# EAGLE schematic sensor pcb 3 (EAGLE 6.1)
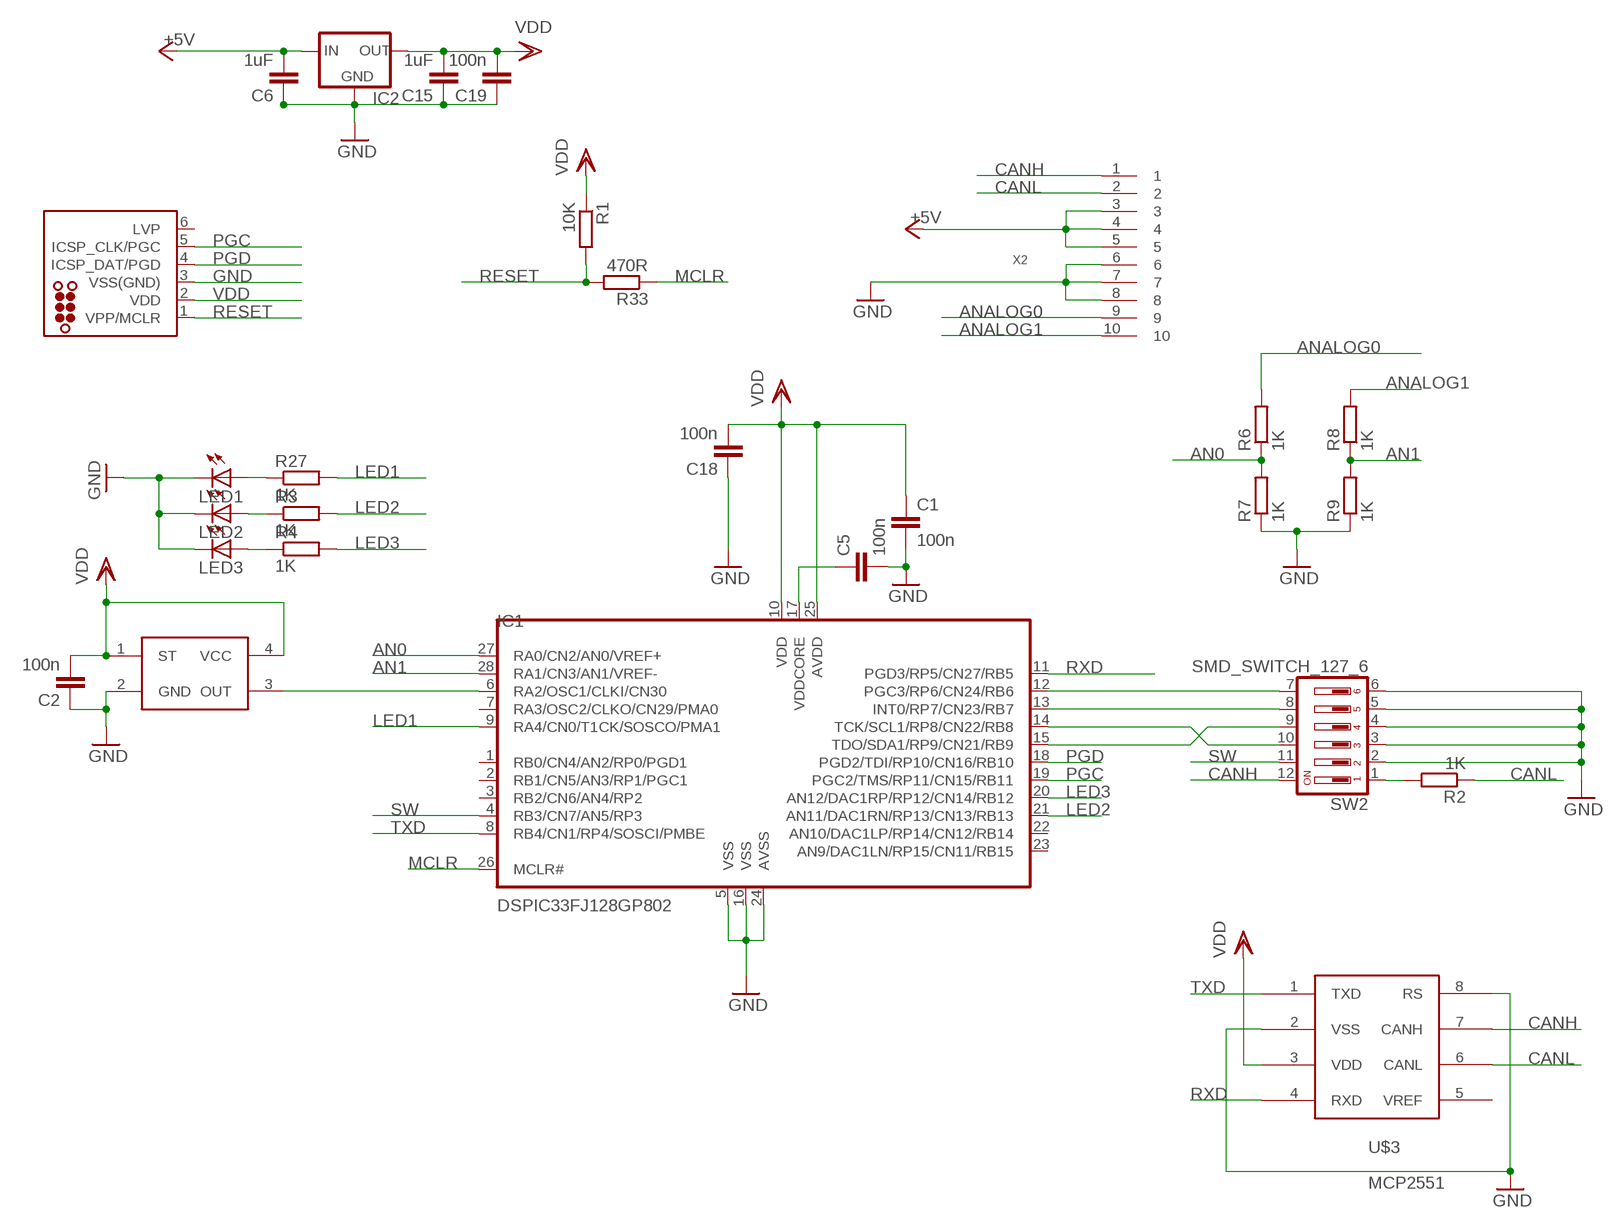
[diagram p0: schematic, sheet 1]

## Parts
C1  100n  C-EUC0402K  [C0402K]
C2  100n  C-EUC0402K  [C0402K]
C5  100n  C-EUC0402K  [C0402K]
C6  1uF  C-EUC0402K  [C0402K]
C15  1uF  C-EUC0402K  [C0402K]
C18  100n  C-EUC0402K  [C0402K]
C19  100n  C-EUC0402K  [C0402K]
IC1  DSPIC33FJ128GP802  [QFN-S28-6X6]
IC2  XC63FPM  [SOT23]
J1  TC2030-MCP-NL  [TC2030-MCP-NL]
LED1  LEDCHIPLED_0603  [CHIPLED_0603]
LED2  LEDCHIPLED_0603  [CHIPLED_0603]
LED3  LEDCHIPLED_0603  [CHIPLED_0603]
R1  10K  R-EU_R0402  [R0402]
R2  1K  R-EU_R0402  [R0402]
R3  1K  R-EU_R0402  [R0402]
R4  1K  R-EU_R0402  [R0402]
R6  1K  R-EU_R0402  [R0402]
R7  1K  R-EU_R0402  [R0402]
R8  1K  R-EU_R0402  [R0402]
R9  1K  R-EU_R0402  [R0402]
R27  1K  R-EU_R0402  [R0402]
R33  470R  R-EU_R0402  [R0402]
SW2  SMD_SWITCH_127_6  [SMD_SWITCH_127_6]
U$1  SG-310  [SG-310]
U$3  MCP2551  [999]
X2  10PINJAS  [10PIN0.1]

## Nets
+5V: C6.2 IC2.3(IN) X2.3 X2.4 X2.5
AN0: IC1.27(RA0/CN2/AN0/VREF+) R6.1 R7.2
AN1: IC1.28(RA1/CN3/AN1/VREF-) R8.1 R9.2
ANALOG0: R6.2 X2.9
ANALOG1: R8.2 X2.10
CANH: SW2.12 U$3.7(CANH) X2.1
CANL: R2.1 U$3.6(CANL) X2.2
GND: C1.2 C2.1 C5.2 C6.1 C15.1 C18.1 C19.1 IC1.5(VSS) IC1.16(VSS) IC1.24(AVSS) IC2.1(GND) J1.3(VSS(GND)) LED1.C LED2.C LED3.C R7.1 R9.1 SW2.2 SW2.3 SW2.4 SW2.5 SW2.6 U$1.2(GND) U$3.2(VSS) U$3.8(RS) X2.6 X2.7 X2.8
LED1: IC1.9(RA4/CN0/T1CK/SOSCO/PMA1) R27.2
LED2: IC1.21(AN11/DAC1RN/RP13/CN13/RB13) R3.2
LED3: IC1.20(AN12/DAC1RP/RP12/CN14/RB12) R4.2
MCLR: IC1.26(MCLR#) R33.1
N$1: IC1.12(PGC3/RP6/CN24/RB6) SW2.7
N$2: IC1.13(INT0/RP7/CN23/RB7) SW2.8
N$3: IC1.15(TDO/SDA1/RP9/CN21/RB9) SW2.9
N$4: IC1.14(TCK/SCL1/RP8/CN22/RB8) SW2.10
N$5: IC1.6(RA2/OSC1/CLKI/CN30) U$1.3(OUT)
N$6: C5.1 IC1.17(VDDCORE)
N$8: R2.2 SW2.1
N$9: LED2.A R3.1
N$10: LED3.A R4.1
N$23: LED1.A R27.1
PGC: IC1.19(PGC2/TMS/RP11/CN15/RB11) J1.5(ICSP_CLK/PGC)
PGD: IC1.18(PGD2/TDI/RP10/CN16/RB10) J1.4(ICSP_DAT/PGD)
RESET: J1.1(VPP/MCLR) R1.2 R33.2
RXD: IC1.11(PGD3/RP5/CN27/RB5) U$3.4(RXD)
SW: IC1.4(RB3/CN7/AN5/RP3) SW2.11
TXD: IC1.8(RB4/CN1/RP4/SOSCI/PMBE) U$3.1(TXD)
VDD: C1.1 C2.2 C15.2 C18.2 C19.2 IC1.10(VDD) IC1.25(AVDD) IC2.2(OUT) J1.2(VDD) R1.1 U$1.1(ST) U$1.4(VCC) U$3.3(VDD)
Unconnected: IC1.1(RB0/CN4/AN2/RP0/PGD1) IC1.2(RB1/CN5/AN3/RP1/PGC1) IC1.3(RB2/CN6/AN4/RP2) IC1.7(RA3/OSC2/CLKO/CN29/PMA0) IC1.22(AN10/DAC1LP/RP14/CN12/RB14) IC1.23(AN9/DAC1LN/RP15/CN11/RB15) J1.6(LVP) U$3.5(VREF)

## Library data of the parts
C1 C2 C5 C6 C15 C18 C19 = rcl:C-EU: CAPACITOR, European symbol
IC1 = microchip-dspic:DSPIC33FJ128GP802
IC2 = v-reg:XC63FP: Positiv Voltage Regulators www.torex.co.jp/english/product/pro02/pdf/0201_xc62fp.pdf
J1 = tag-connect:TC2030: TAG-CONNECT ICSP Connector Manufacturer: Tag-Connect <http://www.tag-connect.com> Cable for easy In-Circuit Serial Programming. Designed for Microchip ICD2, suitable for many others. Two variants - one "with legs" (for hands-free fit on PCB) and another "without legs" for quick programming. PAD Description 1 MCLR/Vpp 2 Vdd 3 GND 4 PGD (ISPDAT) 5 PGC (ISPCLK) 6 nc (used for LVP) ©2009 ROFA.cz - modified and updated by Robert Darlington ‹rdarlington@gmail.com›
LED1-LED3 = led:LED: LED OSRAM: - CHIPLED LG R971, LG N971, LY N971, LG Q971, LY Q971, LO R971, LY R971 LH N974, LH R974 LS Q976, LO Q976, LY Q976 LO Q996 - Hyper CHIPLED LW Q18S LB Q993, LB Q99A, LB R99A - SideLED LS A670, LO A670, LY A670, LG A670, LP A670 LB A673, LV A673, LT A673, LW A673 LH A674 LY A675 LS A676, LA A676, LO A676, LY A676, LW A676 LS A679, LY A679, LG A679 - Hyper Micro SIDELED® LS Y876, LA Y876, LO Y876, LY Y876 LT Y87S - SmartLED LW L88C, LW L88S LB L89C, LB L89S, LG L890 LS L89K, LO L89K, LY L89K LS L896, LA L896, LO L896, LY L896 - TOPLED LS T670, LO T670, LY T670, LG T670, LP T670 LSG T670, LSP T670, LSY T670, LOP T670, LYG T670 LG T671, LOG T671, LSG T671 LB T673, LV T673, LT T673, LW T673 LH T674 LS T676, LA T676, LO T676, LY T676, LB T676, LH T676, LSB T676, LW T676 LB T67C, LV T67C, LT T67C, LS T67K, LO T67K, LY T67K, LW E67C LS E67B, LA E67B, LO E67B, LY E67B, LB E67C, LV E67C, LT E67C LW T67C LS T679, LY T679, LG T679 LS T770, LO T770, LY T770, LG T770, LP T770 LB T773, LV T773, LT T773, LW T773 LH T774 LS E675, LA E675, LY E675, LS T675 LS T776, LA T776, LO T776, LY T776, LB T776 LHGB T686 LT T68C, LB T68C - Hyper Mini TOPLED® LB M676 - Mini TOPLED Santana® LG M470 LS M47K, LO M47K, LY M47K Source: http://www.osram.convergy.de LUXEON: - LUMILED® LXK2-PW12-R00, LXK2-PW12-S00, LXK2-PW14-U00, LXK2-PW14-V00 LXK2-PM12-R00, LXK2-PM12-S00, LXK2-PM14-U00 LXK2-PE12-Q00, LXK2-PE12-R00, LXK2-PE12-S00, LXK2-PE14-T00, LXK2-PE14-U00 LXK2-PB12-K00, LXK2-PB12-L00, LXK2-PB12-M00, LXK2-PB14-N00, LXK2-PB14-P00, LXK2-PB14-Q00 LXK2-PR12-L00, LXK2-PR12-M00, LXK2-PR14-Q00, LXK2-PR14-R00 LXK2-PD12-Q00, LXK2-PD12-R00, LXK2-PD12-S00 LXK2-PH12-R00, LXK2-PH12-S00 LXK2-PL12-P00, LXK2-PL12-Q00, LXK2-PL12-R00 Source: www.luxeon.com KINGBRIGHT: KA-3528ASYC Source: www.kingbright.com
R1-R4 R6-R9 R27 R33 = rcl:R-EU_: RESISTOR, European symbol
SW2 = jas new (2):SMD_SWITCH_127_6: Half pitch smd switch Onecall 1605480
U$1 = jas new:SG-310
U$3 = can controller:MCP2551
X2 = jas new:10PINJAS